# EAGLE schematic TemperatureSensor (EAGLE 7.3.0)
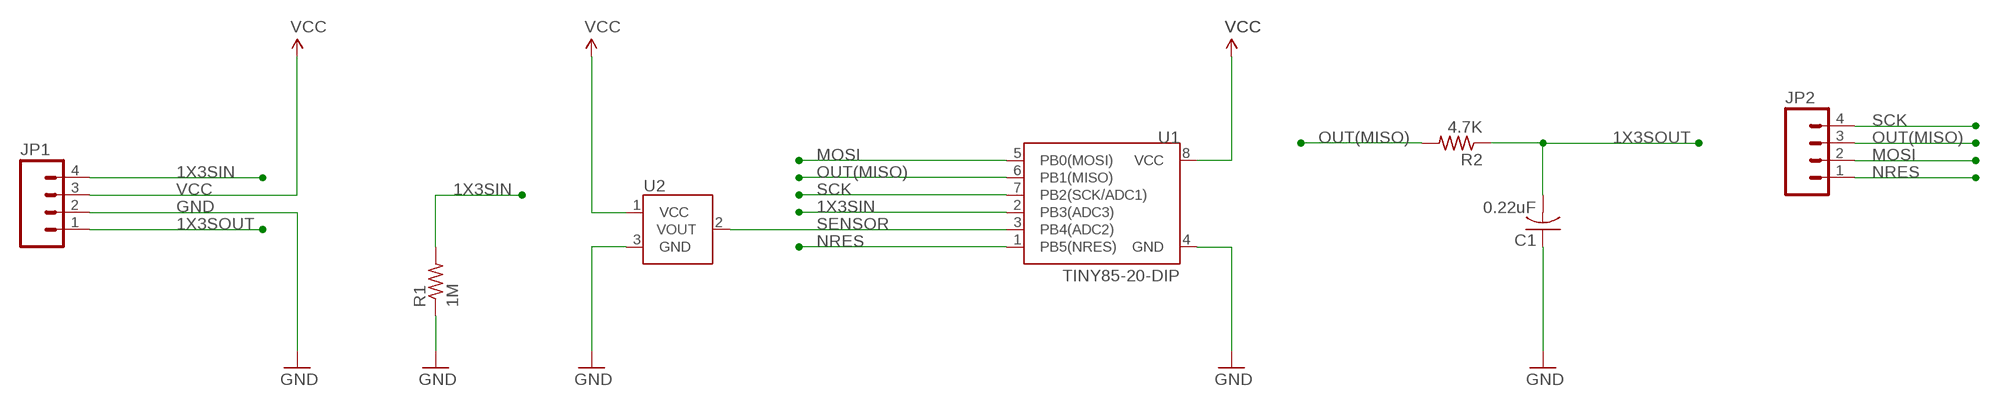
[diagram p0: schematic, sheet 1]

## Parts
C1  0.22uF  C-USC0402  [C0402]
JP1  M04PTH  [1X04]
JP2  M04PTH  [1X04]
R1  1M  R-US_R0603  [R0603]
R2  4.7K  R-US_R0603  [R0603]
U1  TINY85-20-DIP  ATTINY45TINY85-20-DIP  [DIP08]
U2  TMP36GT9  [TO-92]

## Nets
1X3SIN: JP1.4 R1.2 U1.2(PB3(ADC3))
1X3SOUT: C1.2 JP1.1 R2.1
GND: C1.1 JP1.2 R1.1 U1.4(GND) U2.3(GND)
MOSI: JP2.2 U1.5(PB0(MOSI))
NRES: JP2.1 U1.1(PB5(NRES))
OUT(MISO): JP2.3 R2.2 U1.6(PB1(MISO))
SCK: JP2.4 U1.7(PB2(SCK/ADC1))
SENSOR: U1.3(PB4(ADC2)) U2.2(VOUT)
VCC: JP1.3 U1.8(VCC) U2.1(VCC)

## Library data of the parts
C1 = adafruit:C-US: CAPACITOR, American symbol
JP1 JP2 = SparkFun-Connectors:M04: Header 4 Standard 4-pin 0.1" header. Use with straight break away headers (SKU : PRT-00116), right angle break away headers (PRT-00553), swiss pins (PRT-00743), machine pins (PRT-00117), and female headers (PRT-00115). Molex polarized connector foot print use with SKU : PRT-08231 with associated crimp pins and housings. 1MM SMD Version SKU: PRT-10208
R1 R2 = adafruit:R-US_: RESISTOR, American symbol
U1 = SparkFun-DigitalIC:ATTINY45: Atmel 8-pin 2/4/8kB flash uC; PROD_ID: IC-09445
U2 = SparkFun-Sensors:TMP36: Precision degC temp sensor, analog out